# Altium schematic sheet MICRO_SD_CARD.SchDoc
size A4; SheetNumber: 11; SheetTotal: 12
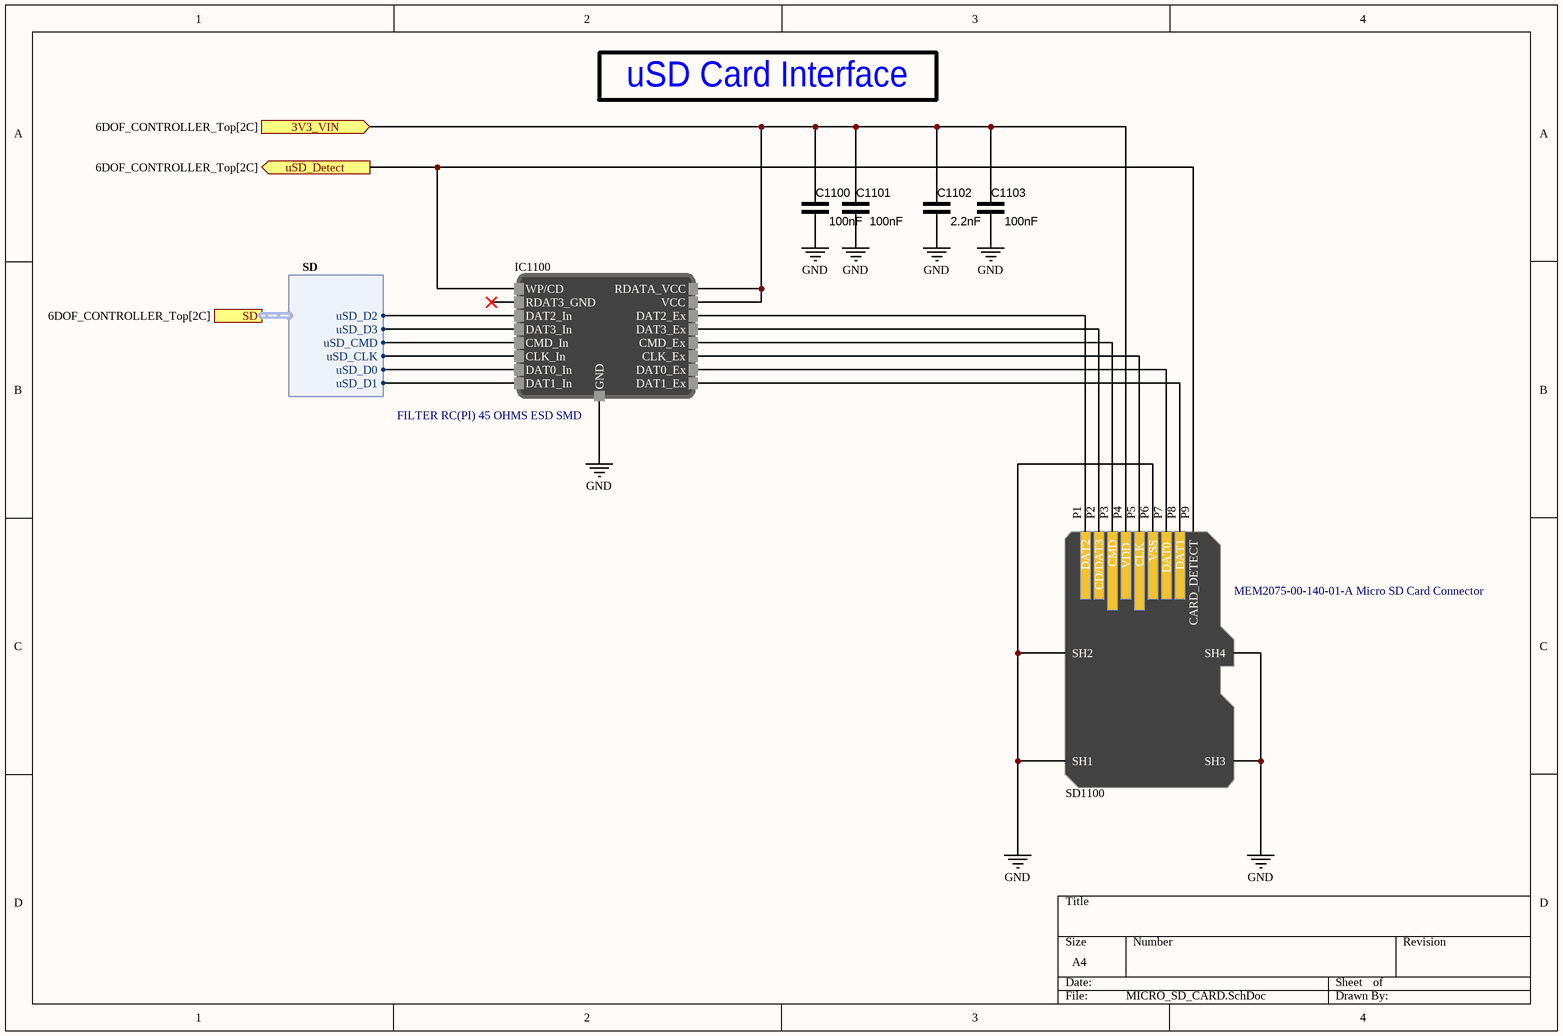
[diagram p0: MICRO_SD_CARD.SchDoc]

## Parts
C1100  100nF  [CAP_0603]
C1101  100nF  [CAP_0603]
C1102  2.2nF  [CAP_0603]
C1103  100nF  [CAP_0603]
IC1100  FILTER RC(PI) 45 OHMS ESD SMD  [Micro QFN 3.5x1.2-16L]
SD1100  MEM2075-00-140-01-A Micro SD Card Connector  [uSD_CARD_9(8+1)]

## Ports
3V3_VIN (in, see 6DOF_CONTROLLER_Top[2C]), SD (harness SD, see 6DOF_CONTROLLER_Top[2C]), uSD_Detect (out, see 6DOF_CONTROLLER_Top[2C])

## Harnesses
SD: uSD_D2, uSD_D3, uSD_CMD, uSD_CLK, uSD_D0, uSD_D1

## Nets
GND: C1100.1 C1101.1 C1102.1 C1103.1 IC1100.17(GND) SD1100.P6(VSS) SD1100.SH1 SD1100.SH2 SD1100.SH3 SD1100.SH4
3V3_VIN: C1100.2 C1101.2 C1102.2 C1103.2 IC1100.15(VCC) IC1100.16(RDATA_VCC) SD1100.P4(VDD) ; port 3V3_VIN
uSD_Detect: IC1100.1(WP/CD) SD1100.P9(CARD_DETECT) ; port uSD_Detect
NetIC1100_3: IC1100.3(DAT2_In) ; port SD.uSD_D2
NetIC1100_4: IC1100.4(DAT3_In) ; port SD.uSD_D3
NetIC1100_5: IC1100.5(CMD_In) ; port SD.uSD_CMD
NetIC1100_6: IC1100.6(CLK_In) ; port SD.uSD_CLK
NetIC1100_7: IC1100.7(DAT0_In) ; port SD.uSD_D0
NetIC1100_8: IC1100.8(DAT1_In) ; port SD.uSD_D1
NetIC1100_9: IC1100.9(DAT1_Ex) SD1100.P8(DAT1)
NetIC1100_10: IC1100.10(DAT0_Ex) SD1100.P7(DAT0)
NetIC1100_11: IC1100.11(CLK_Ex) SD1100.P5(CLK)
NetIC1100_12: IC1100.12(CMD_Ex) SD1100.P3(CMD)
NetIC1100_13: IC1100.13(DAT3_Ex) SD1100.P2(CD/DAT3)
NetIC1100_14: IC1100.14(DAT2_Ex) SD1100.P1(DAT2)

Not connected (* = marked no-connect by the designer): IC1100 2(RDAT3_GND)*

## Notes on the sheet
- uSD Card Interface

## Library data of the parts
C1100 C1101 C1103 = C000007: 0.1 µF ±10% 25V Ceramic Capacitor X7R 0603 (1608 Metric); ComponentLink1Description: DigiKey; ComponentLink1URL: https://www.digikey.com/en/products/detail/kyocera-avx/06033C104K4T2A/8019250; DigiKey Part Number: 478-KAM15AR71E104KTCT-ND; capacitance: 100nF
C1102 = C000006: 2200 pF ±10% 25V Ceramic Capacitor X7R 0603 (1608 Metric); ComponentLink1Description: DigiKey; ComponentLink1URL: https://www.digikey.com/en/products/detail/yageo/CC0603KRX7R8BB222/2345066; DigiKey Part Number: 311-3653-1-ND; capacitance: 2.2nF
IC1100 = EMIF06-MSD02N16: RC (Pi) EMI Filter 2nd Order Low Pass 6 Channel R = 45Ohms, C = 20pF (Total) 16-UFDFN Exposed Pad; Digikey Part Number: 497-8751-1-ND; Digikey Link: https://www.digikey.com/en/products/detail/stmicroelectronics/EMIF06-MSD02N16/2043592?s=N4IgTCBcDaIKIFkCSAxADANgLQIMoBE0wA5ARgxAF0BfIA
SD1100 = 00000015: 9 (8 + 1) Position Card Connector Secure Digital - microSD™ Surface Mount, Right Angle Gold; DigiKey Part Number: 2073-MEM2075-00-140-01-ACT-ND; Mouser Part Number: 640-MEM20750014001A; ComponentLink1Description: DigiKey; ComponentLink1URL: https://www.digikey.com/en/products/detail/gct/MEM2075-00-140-01-A/9859614?s=N4IgTCBcDaILIFE5gAwHYCsBaFKsEYAWPFfLAQRAF0BfIA; ComponentLink2Description: Mouser; ComponentLink2URL: https://eu.mouser.com/ProductDetail/GCT/MEM2075-00-140-01-A?qs=KUoIvG%2F9IlZvfWpeERlq3Q%3D%3D